# EAGLE design working (EAGLE 9.6.2)
COMPANY: ADAFRUIT INDUSTRIES; DRAWN: KTOWN; REV: A; YEAR: 2018
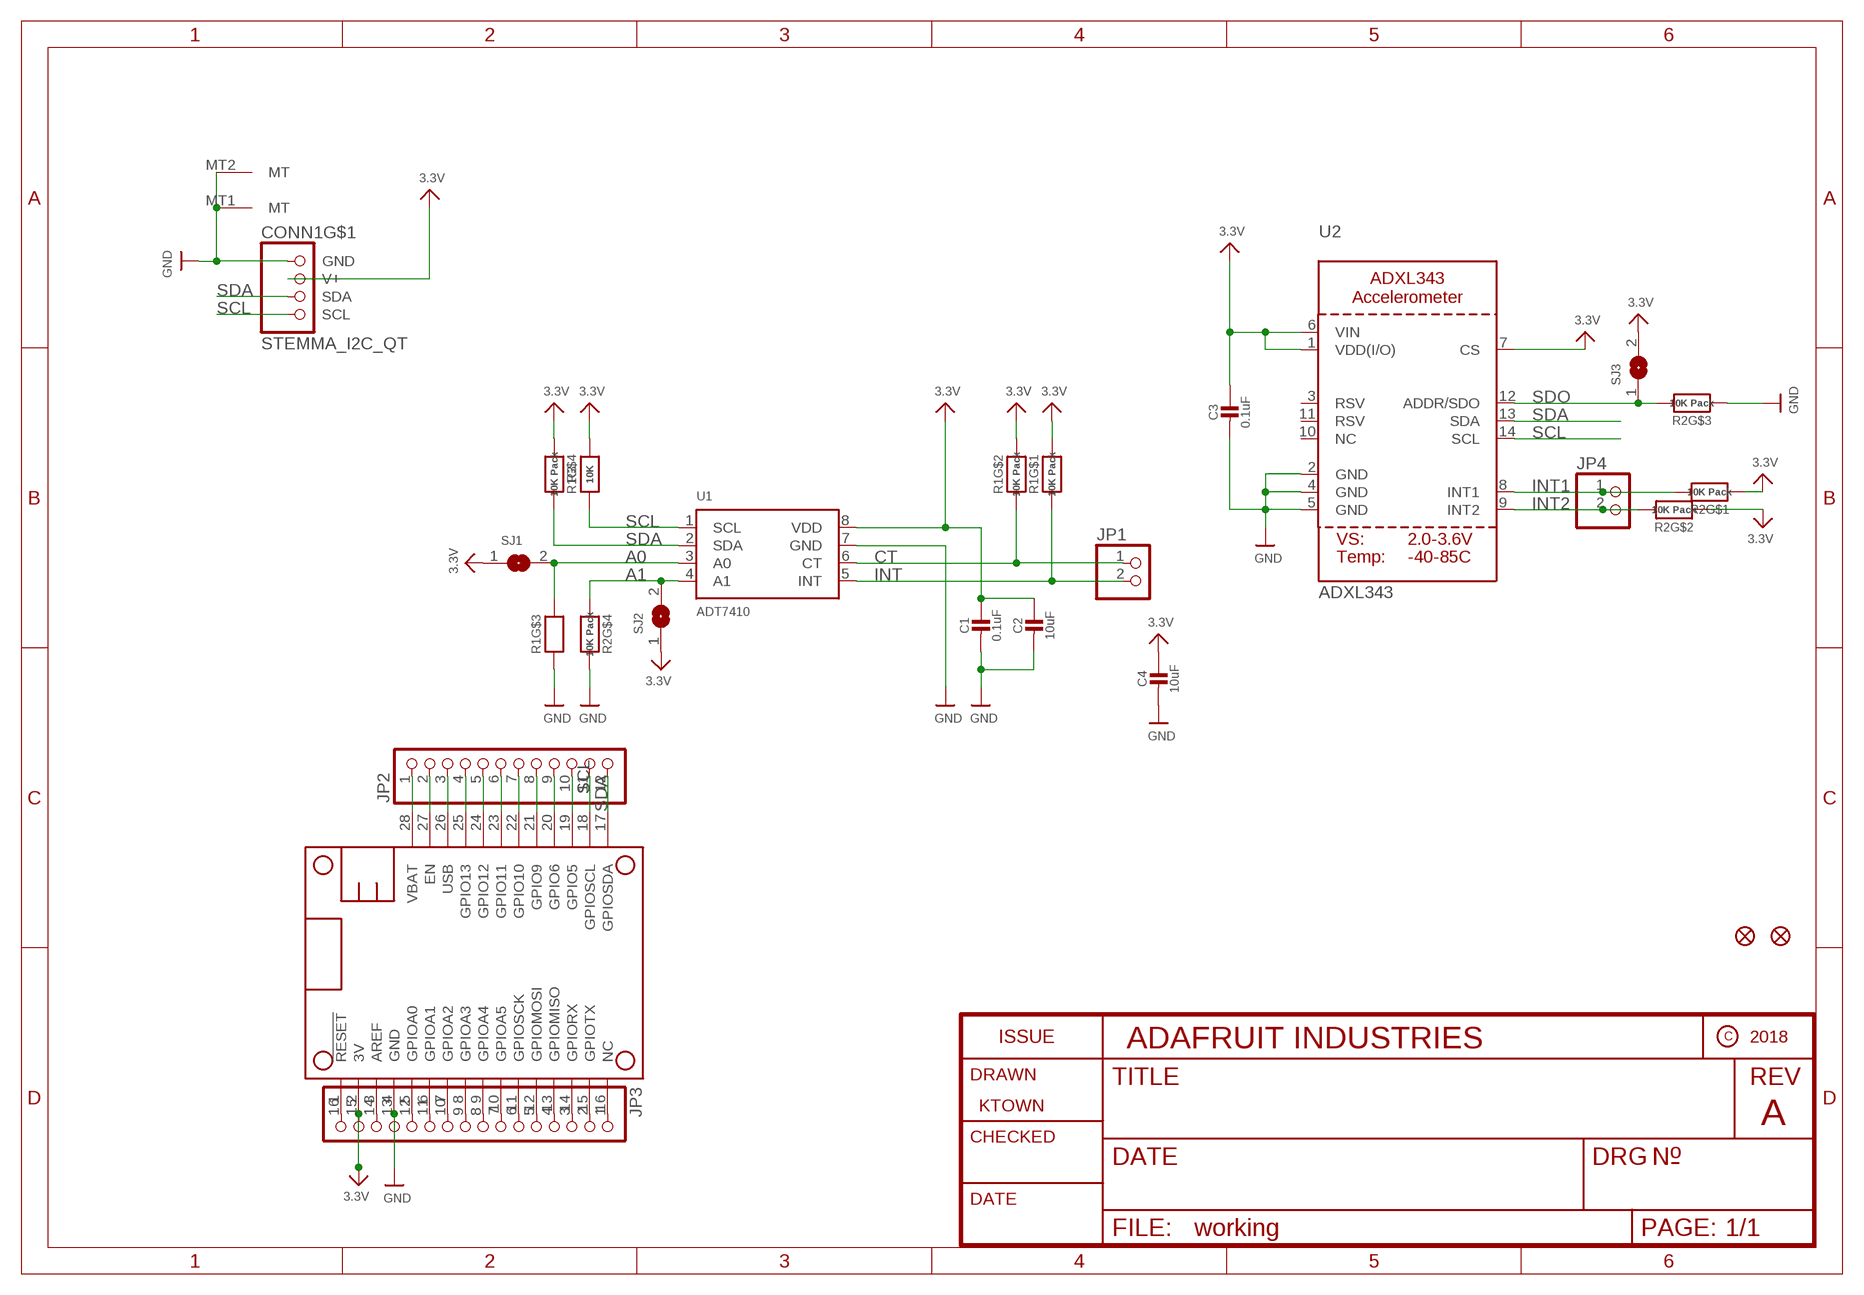
[diagram p0: schematic, sheet 1]

## Parts
C1  0.1uF  CAP_CERAMIC0603_NO  [0603-NO]
C2  10uF  CAP_CERAMIC0805-NOOUTLINE  [0805-NO]
C3  0.1uF  CAP_CERAMIC0603_NO  [0603-NO]
C4  10uF  CAP_CERAMIC0805-NOOUTLINE  [0805-NO]
CONN1  STEMMA_I2C_QT  [JST_SH4]
FID1  FIDUCIAL_1MM  [FIDUCIAL_1MM]
FID2  FIDUCIAL_1MM  [FIDUCIAL_1MM]
JP1  HEADER-1X2ROUND  [1X02_ROUND]
JP2  HEADER-1X1276MIL  [1X12_ROUND_76MIL]
JP3  HEADER-1X16_76MIL  [1X16_ROUND_76MIL]
JP4  HEADER-1X2ROUND  [1X02_ROUND]
MS1  FEATHERWING_NODIM  [FEATHERWING_NODIM]
R1  10K Pack  RESISTOR_4PACK  [RESPACK_4X0603]
R2  10K Pack  RESISTOR_4PACK  [RESPACK_4X0603]
R3  10K  RESISTOR_0603_NOOUT  [0603-NO]
SJ1  SOLDERJUMPER  [SOLDERJUMPER_ARROW_NOPASTE]
SJ2  SOLDERJUMPER  [SOLDERJUMPER_ARROW_NOPASTE]
SJ3  SOLDERJUMPER  [SOLDERJUMPER_ARROW_NOPASTE]
U1  ADT7410  TEMP_ADT7410  [SOIC8_150MIL]
U2  ADXL343  ACCEL_ADXL343  [LGA14]

## Nets
3.3V: C1.1 C2.1 C3.1 C4.1 CONN1.2(V+) JP3.15 MS1.2(3V) R1.4 R1.7 R1.8 R2.1 R2.2 R3.2 SJ1.1 SJ2.1 SJ3.2 U1.8(VDD) U2.1(VDD(I/O)) U2.6(VIN) U2.7(CS)
A0: R1.6 SJ1.2 U1.3(A0)
A1: R2.4 SJ2.2 U1.4(A1)
CT: JP1.1 R1.2 U1.6(CT)
GND: C1.2 C2.2 C3.2 C4.2 CONN1.1(GND) CONN1.MT1(MT) CONN1.MT2(MT) JP3.13 MS1.4(GND) R1.3 R2.3 R2.5 U1.7(GND) U2.2(GND) U2.4(GND) U2.5(GND)
INT: JP1.2 R1.1 U1.5(INT)
INT1: JP4.1 R2.8 U2.8(INT1)
INT2: JP4.2 R2.7 U2.9(INT2)
N$1: JP2.2 MS1.27(EN)
N$2: JP2.4 MS1.25(GPIO13)
N$3: JP2.5 MS1.24(GPIO12)
N$4: JP2.6 MS1.23(GPIO11)
N$5: JP2.7 MS1.22(GPIO10)
N$6: JP2.8 MS1.21(GPIO9)
N$7: JP2.9 MS1.20(GPIO6)
N$8: JP2.10 MS1.19(GPIO5)
N$11: JP3.1 MS1.16(NC)
N$12: JP3.2 MS1.15(GPIOTX)
N$13: JP3.3 MS1.14(GPIORX)
N$14: JP3.4 MS1.13(GPIOMISO)
N$15: JP3.5 MS1.12(GPIOMOSI)
N$16: JP3.6 MS1.11(GPIOSCK)
N$17: JP3.7 MS1.10(GPIOA5)
N$18: JP3.8 MS1.9(GPIOA4)
N$19: JP3.9 MS1.8(GPIOA3)
N$20: JP3.10 MS1.7(GPIOA2)
N$21: JP3.11 MS1.6(GPIOA1)
N$22: JP3.12 MS1.5(GPIOA0)
N$24: JP3.14 MS1.3(AREF)
N$25: JP3.16 MS1.1(!RESET)
SCL: CONN1.4(SCL) JP2.11 MS1.18(GPIOSCL) R3.1 U1.1(SCL) U2.14(SCL)
SDA: CONN1.3(SDA) JP2.12 MS1.17(GPIOSDA) R1.5 U1.2(SDA) U2.13(SDA)
SDO: R2.6 SJ3.1 U2.12(ADDR/SDO)
USB: JP2.3 MS1.26(USB)
VBAT: JP2.1 MS1.28(VBAT)
Unconnected: U2.3(RSV) U2.10(NC) U2.11(RSV)

## Library data of the parts
C1-C4 = microbuilder:CAP_CERAMIC: Ceramic Capacitors For new designs, use the packages preceded by an '_' character since they are more reliable: The following footprints should be used on most boards: _0402 - Standard footprint for regular board layouts _0603 - Standard footprint for regular board layouts _0805 - Standard footprint for regular board layouts _1206 - Standard footprint for regular board layouts For extremely tight-pitch boards where space is at a premium, the following 'micro-pitch' footprints can be used (smaller pads, no silkscreen outline, etc.): _0402MP - Micro-pitch footprint for very dense/compact boards _0603MP - Micro-pitch footprint for very dense/compact boards _0805MP - Micro-pitch footprint for very dense/compact boards _1206MP - Micro-pitch footprint for very dense/compact boards
CONN1 = adafruit_electromech:STEMMA_I2C; LCSC: C2845363
FID1 FID2 = microbuilder:FIDUCIAL: Fiducial Alignment Points Various fiducial points for machine vision alignment.; BOM: EXCLUDE
JP1 JP4 = microbuilder:HEADER-1X2: PIN HEADER
JP2 = microbuilder:HEADER-1X12
JP3 = microbuilder:HEADER-1X16: PIN HEADER
MS1 = microbuilder:FEATHERWING
R1 R2 = microbuilder:RESISTOR_4PACK: Resistor Packs (4 resistors) 4 x 0603 10K 1/16W - Digikey: YC164J-10KCT-ND
R3 = microbuilder:RESISTOR: Resistors For new designs, use the packages preceded by an '_' character since they are more reliable: The following footprints should be used on most boards: _0402 - Standard footprint for regular board layouts _0603 - Standard footprint for regular board layouts _0805 - Standard footprint for regular board layouts _1206 - Standard footprint for regular board layouts For extremely tight-pitch boards where space is at a premium, the following 'micro-pitch' footprints can be used (smaller pads, no silkscreen outline, etc.): _0402MP - Micro-pitch footprint for very dense/compact boards _0603MP - Micro-pitch footprint for very dense/compact boards _0805MP - Micro-pitch footprint for very dense/compact boards _1206MP - Micro-pitch footprint for very dense/compact boards
SJ1-SJ3 = microbuilder:SOLDERJUMPER: SMD Solder JUMPER Solder the two pads together to create a connection, or remove the solder to break it. REFLOW - Use this footprint for solder paste and reflow ovens. WAVE - Use this footprint for hand-soldering (larger pads). CLOSED - Has a trace between the two pads to ensure it is closed by default. The trace needs to be cut to disable the jumper, and can be closed again by creating a solder bridge between the two pads.; BOM: EXCLUDE
U1 = adafruit_sensor:TEMP_ADT7410: ADT7410 - 13-bit 0.5°C I2C Temperature Sensor Operating Voltage: 2.7-5.5V Temperature Range: -55°C-150°C Accuracy: 0.5°C from -40°C-105°C Shutdown Current: 2uA (3.3V) Typical Operating Current (1 Sample/s): 46uA (3.3V) Digikey: ADT7410TRZ-ND
U2 = adafruit_sensor:ACCEL_ADXL343: ADXL343 - Digital Accelerometer 2/4/8/16g

## Board
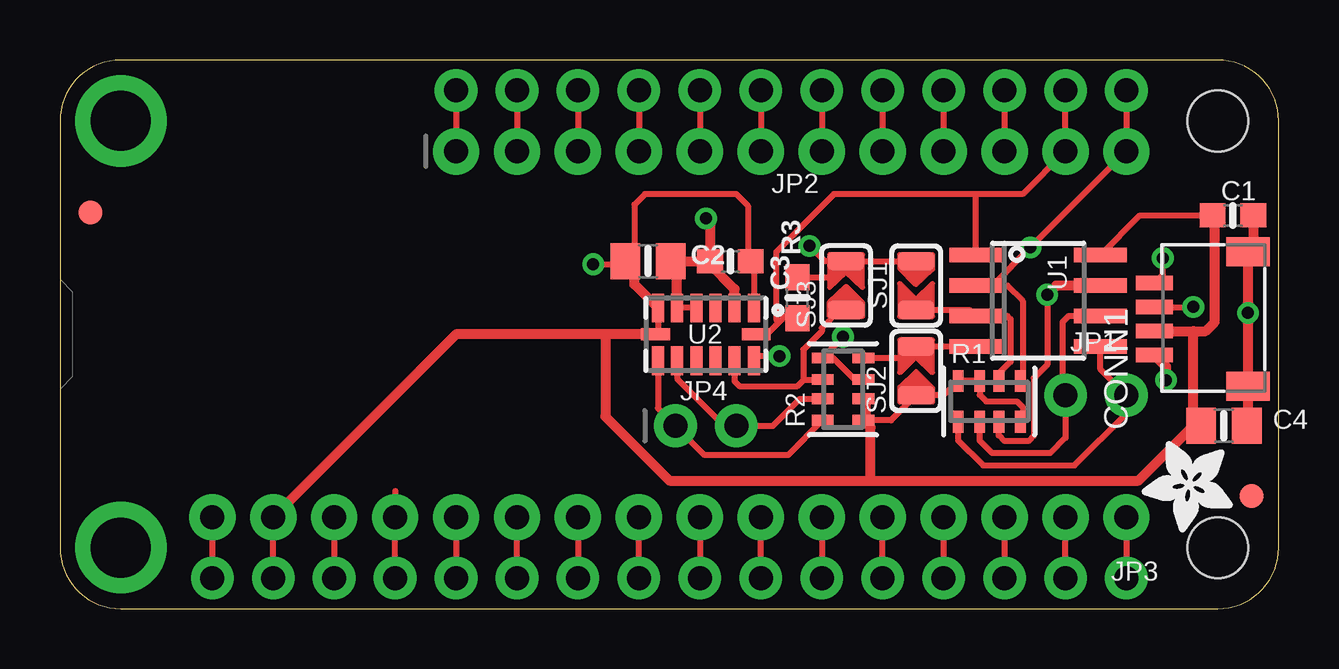
[diagram p1: board, top side]
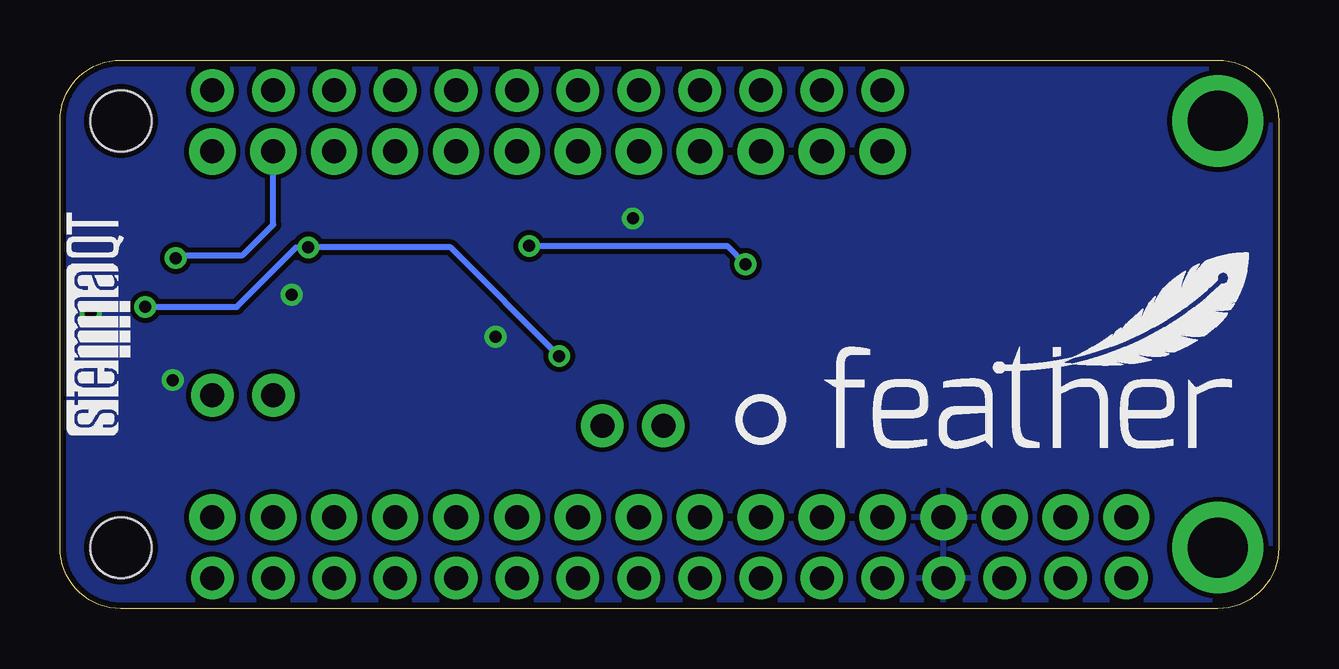
[diagram p2: board, bottom side, seen from below]

Size 50.8 x 22.86 mm. Coordinates in mm from the lower left corner, seen from the top.
Outline: 2.54,0 48.26,0 arc90 50.8,2.54 50.8,20.32 arc90 48.26,22.86 2.54,22.86 arc90 0,20.32 0,2.54 arc90 2.54,0
Copper layers (1*16): Top 0.035mm / dielectric 1.5mm / Bottom 0.035mm
Design rules "adafruit": minimum track width 8mil, minimum drill 15.5mil, track to track 8mil, track to pad 8mil, pad to pad 8mil, via to via 8mil, smd to smd 8mil, copper to edge 10mil, drill to drill 8mil, minimum pad ring 10mil, minimum via ring 8mil, stop-mask expansion 2mil, vias tented up to drill 20mil, thermal gap 10mil

### Footprints (pad centres in the part's own frame; a part is rotated, then mirrored left to right if it is on the bottom)
0603-NO = smd 1.075 x 1: 1 -0.85,0; 2 0.85,0
0805-NO = smd 1.24 x 1.5: 1 -0.95,0; 2 0.95,0
JST_SH4 = smd 0.6 x 1.55: 1 -1.5,2.006; 2 -0.5,2.006; 3 0.5,2.006; 4 1.5,2.006 | smd 1.2 x 1.8: MT1 -2.8,-1.894; MT2 2.8,-1.894
FIDUCIAL_1MM = smd 1 x 1: 1 0,0
1X02_ROUND = drill 1 pad 1.778: 1 -1.27,0; 2 1.27,0
1X12_ROUND_76MIL = drill 1 pad 1.93: 1 -13.97,0; 2 -11.43,0; 3 -8.89,0; 4 -6.35,0; 5 -3.81,0; 6 -1.27,0; 7 1.27,0; 8 3.81,0; 9 6.35,0; 10 8.89,0; 11 11.43,0; 12 13.97,0
1X16_ROUND_76MIL = drill 1 pad 1.93: 1 -19.05,0; 2 -16.51,0; 3 -13.97,0; 4 -11.43,0; 5 -8.89,0; 6 -6.35,0; 7 -3.81,0; 8 -1.27,0; 9 1.27,0; 10 3.81,0; 11 6.35,0; 12 8.89,0; 13 11.43,0; 14 13.97,0; 15 16.51,0; 16 19.05,0
FEATHERWING_NODIM = drill 1 pad 1.778: 1 6.35,1.27; 2 8.89,1.27; 3 11.43,1.27; 4 13.97,1.27; 5 16.51,1.27; 6 19.05,1.27; 7 21.59,1.27; 8 24.13,1.27; 9 26.67,1.27; 10 29.21,1.27; 11 31.75,1.27; 12 34.29,1.27; 13 36.83,1.27; 14 39.37,1.27; 15 41.91,1.27; 16 44.45,1.27; 17 44.45,21.59; 18 41.91,21.59; 19 39.37,21.59; 20 36.83,21.59; 21 34.29,21.59; 22 31.75,21.59; 23 29.21,21.59; 24 26.67,21.59; 25 24.13,21.59; 26 21.59,21.59; 27 19.05,21.59; 28 16.51,21.59 | drill 2.5 pad 3.81: P$1 2.54,20.32; P$2 2.54,2.54 | hole 2.54: 48.26,20.32; 48.26,2.54
RESPACK_4X0603 = smd 0.45 x 0.9: 1 -1.3,-0.85; 2 -0.4,-0.85; 3 0.4,-0.85; 4 1.3,-0.85; 5 1.3,0.85; 6 0.4,0.85; 7 -0.4,0.85; 8 -1.3,0.85
SOLDERJUMPER_ARROW_NOPASTE = smd 0.762 x 1.524: 1 -1.016,0; 2 1.016,0
SOIC8_150MIL = smd 0.6 x 2.2: 1 -1.905,-2.6; 2 -0.635,-2.6; 3 0.635,-2.6; 4 1.905,-2.6; 5 1.905,2.6; 6 0.635,2.6; 7 -0.635,2.6; 8 -1.905,2.6
LGA14 = smd 0.5 x 1.2: 1 2,1.1; 2 1.2,1.1; 3 0.4,1.1; 4 -0.4,1.1; 5 -1.2,1.1; 6 -2,1.1; 8 -2,-1.1; 9 -1.2,-1.1; 10 -0.4,-1.1; 11 0.4,-1.1; 12 1.2,-1.1; 13 2,-1.1 | smd 1.2 x 0.5: 7 -2.1,0; 14 2.1,0

### Placement (x,y rotation side)
C1  48.9,16.38 0 top
C2  24.51,14.48 0 top
C3  27.94,14.48 180 top
C4  48.51,7.62 0 top
CONN1  47.62,12.06 90 top
FID1  1.27,16.51 0 top
FID2  49.66,4.7 0 top
JP1  43.18,8.89 0 top
JP2  30.48,19.05 0 top
JP3  25.4,3.81 180 top
JP4  26.92,7.62 0 top
MS1  0,0 0 top
R1  38.73,8.64 0 top
R2  32.64,9.14 90 top
R3  30.73,12.95 90 top
SJ1  35.69,13.46 270 top
SJ2  35.69,9.91 90 top
SJ3  32.77,13.46 90 top
U1  40.77,12.83 270 top
U2  26.92,11.43 0 top
U$1  [PCBFEAT-REV-040]  21.59,7.87 0 bottom
U$23  [FEATHERLOGO_MED]  19.05,6.6 0 bottom
U$24  [ADIWING_TOP]  0,0 0 top
U$28  [ADAFRUIT_3.5MM]  48.9,6.99 180 top
U$29  [STEMMAQT]  47.88,7.24 90 bottom

### Tracks (layer width: path | path; a pad name or v marks a point on that pad's centre or on a via)
3.3V  (via drill 0.5)
  Top 0.254: MS1.2 JP3.15 | U2.1 28.92,14.34 C3.1 28.67,14.6 28.67,16.8 28.19,17.27 24.38,17.27 23.94,16.83 23.94,14.73 23.69,14.48 C2.1 | U2.7 24.92,11.53 U2.6 | SJ3.2 SJ1.1 | U1.8 45.02,16.38 47.88,16.38 | 47.88,16.38 C1.1 | 48.13,16.13 47.88,16.38 | 33.66,7.84 34.64,7.84 SJ2.1 36.84,8.89 R1.8 R1.7 38.34,8.91 38.61,8.64 39.88,8.64 40.13,8.38 40.13,7.88 R1.4 | 33.66,7.84 R2.1 | R2.2 33.66,8.58 33.66,7.84 | SJ3.2 31.88,14.48 v31.24,15.11 | v22.23,14.35 23.94,14.35 | R3.2 32.03,13.8 32.22,13.93 SJ3.2 | C4.1 47.24,7.62
  Top 0.406: JP3.15 16.51,11.43 22.73,11.43 | U2.7 22.73,11.43 | 33.78,5.33 25.4,5.33 22.73,8 22.73,11.43 | U2.6 23.94,13.51 23.94,14.35 23.94,14.73 | CONN1.2 47.24,11.56 | 47.24,11.56 47.76,11.56 48.13,11.94 48.13,16.13 | 33.78,5.33 44.96,5.33 47.24,7.62 47.24,11.56 | 33.78,5.33 33.78,7.55 R2.1
  Bottom 0.254: v31.24,15.11 22.99,15.11 v22.23,14.35
A0
  Top 0.254: SJ1.2 37.91,12.45 U1.3 39.5,12.19 39.62,12.06 39.62,10.29 39.13,9.8 R1.6
A1
  Top 0.254: U1.4 SJ2.2 35.69,10.79 35.34,10.44 R2.4
CT
  Top 0.254: U1.6 42.04,12.19 41.78,11.94 41.78,9.02 JP1.1 41.91,7.11 41.27,6.48 38.86,6.48 38.34,7 R1.2
GND  (via drill 0.5)
  Top 0.254: MS1.4 JP3.13 13.97,4.89 | U2.4 | U2.4 26.42,12.53 | U2.4 26.42,12.53 | 26.42,12.53 U2.5 | 25.59,14.48 25.91,14.48 | v41.15,13.08 41.15,10.16 40.59,9.6 40.59,7.2 40.38,6.99 39.37,6.99 39.13,7.22 R1.3 | R2.3 33.13,9.54 32.23,10.44 R2.5 32.64,11.29 v32.64,11.32
  Top 0.406: U2.5 25.72,14.29 25.91,14.48 | 25.59,14.48 C2.2 C3.2 | v26.92,16.26 27.09,16.09 C3.2 | U2.2 28.12,13.32 27.09,14.35 C3.2 | C1.2 49.74,15.09 CONN1.MT2 v49.52,12.32 CONN1.MT1 49.52,7.67 C4.2 | U1.7 41.53,13.46 v41.15,13.08 | CONN1.1 46.1,10.08 v46.1,9.53
  pour Bottom: 0,22.86 50.8,22.86 50.8,0 0,0
INT
  Top 0.254: R1.1 37.44,7.01 38.48,5.97 42.29,5.97 44.45,8.13 JP1.2 43.37,9.97 U1.5
INT1
  Top 0.254: U2.8 24.92,8.35 JP4.1 26.87,6.4 30.35,6.4 R2.8
INT2
  Top 0.254: U2.9 25.72,9.58 27.69,7.62 JP4.2 29.72,7.62 30.84,8.74 R2.7
N$1
  Top 0.254: MS1.27 JP2.2
N$2
  Top 0.254: MS1.25 JP2.4
N$3
  Top 0.254: MS1.24 JP2.5
N$4
  Top 0.254: MS1.23 JP2.6
N$5
  Top 0.254: MS1.22 JP2.7
N$6
  Top 0.254: MS1.21 JP2.8
N$7
  Top 0.254: MS1.20 JP2.9
N$8
  Top 0.254: MS1.19 JP2.10
N$11
  Top 0.254: JP3.1 MS1.16
N$12
  Top 0.254: MS1.15 JP3.2
N$13
  Top 0.254: JP3.3 MS1.14
N$14
  Top 0.254: JP3.4 MS1.13
N$15
  Top 0.254: MS1.12 JP3.5
N$16
  Top 0.254: JP3.6 MS1.11
N$17
  Top 0.254: MS1.10 JP3.7
N$18
  Top 0.254: JP3.8 MS1.9
N$19
  Top 0.254: MS1.8 JP3.9
N$20
  Top 0.254: JP3.10 MS1.7
N$21
  Top 0.254: MS1.6 JP3.11
N$22
  Top 0.254: JP3.12 MS1.5
N$24
  Top 0.254: JP3.14 MS1.3
N$25
  Top 0.254: JP3.16 6.35,2.03 6.1,1.78 6.1,1.52 MS1.1
SCL  (via drill 0.5)
  Top 0.254: MS1.18 JP2.11 40.13,17.27 38.23,17.27 | U2.14 29.46,11.43 29.97,11.94 | 29.97,11.94 30.23,12.19 30.31,12.1 R3.1 | U1.1 38.17,17.21 38.23,17.27 | CONN1.4 45.97,13.92 v45.97,14.61 | 38.23,17.27 32.26,17.27 29.84,14.86 29.84,12.06 29.97,11.94
  Bottom 0.254: v45.97,14.61 45.85,14.73 43.18,14.73 41.91,16 JP2.11
SDA  (via drill 0.5)
  Top 0.254: MS1.17 JP2.12 v40.45,15.05 38.86,13.46 U1.2 39.5,13.46 40.13,12.83 40.13,9.58 R1.5 | U2.13 29.12,10.52 v29.99,10.52 | CONN1.3 v47.24,12.56 v47.24,12.57
  Bottom 0.254: v29.99,10.52 34.52,15.05 v40.45,15.05 40.96,15.05 43.43,12.57 v47.24,12.57
SDO
  Top 0.254: U2.12 28.12,9.47 28.32,9.27 30.73,9.27 30.99,9.53 | R2.6 31.01,9.54 30.99,9.53 | 30.99,9.53 30.99,10.79 31.75,11.56 31.75,11.68 32.51,12.45 SJ3.1
USB
  Top 0.254: MS1.26 JP2.3
VBAT
  Top 0.254: MS1.28 JP2.1